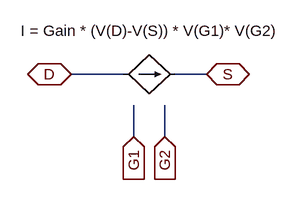
[diagram p0: schematic nmdar.asc]
nmdar.asc, the LTspice schematic file:
Version 4
SHEET 1 880 680
WIRE 64 112 -16 112
WIRE 192 112 144 112
WIRE 80 208 80 160
WIRE 128 208 128 160
FLAG -16 112 D
IOPIN -16 112 BiDir
FLAG 80 208 G1
IOPIN 80 208 In
FLAG 192 112 S
IOPIN 192 112 BiDir
FLAG 128 208 G2
IOPIN 128 208 In
SYMBOL bi2 144 112 R90
WINDOW 0 -32 84 Invisible 2
WINDOW 3 -82 39 VTop 2
SYMATTR InstName B1
SYMATTR Value I = Gain * (V(D)-V(S)) * V(G1)* V(G2)

The netlist it stands for:
* nmdar.asc
B1 D S I = Gain * (V(D)-V(S)) * V(G1)* V(G2)
.backanno
.end